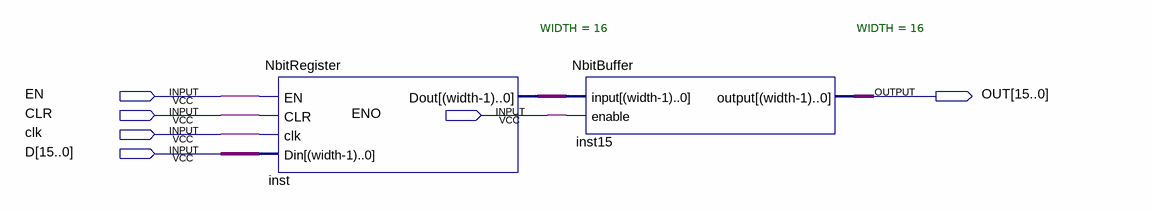
[diagram p0: schematic sheet]
// Quartus schematic BufferedRegister.bdf as structural Verilog: 2 symbols, 6 pins
module BufferedRegister (
  input  EN,
  input  CLR,
  input  ENO,
  input  clk,
  input  [15:0] D,
  output [15:0] OUT
);

  wire [15:0] inst_dout;

  NbitRegister #(.WIDTH(16)) inst (.EN(EN), .CLR(CLR), .clk(clk), .Din(D), .Dout(inst_dout));
  NbitBuffer #(.WIDTH(16)) inst15 (.\input (inst_dout), .enable(ENO), .\output (OUT));
endmodule
